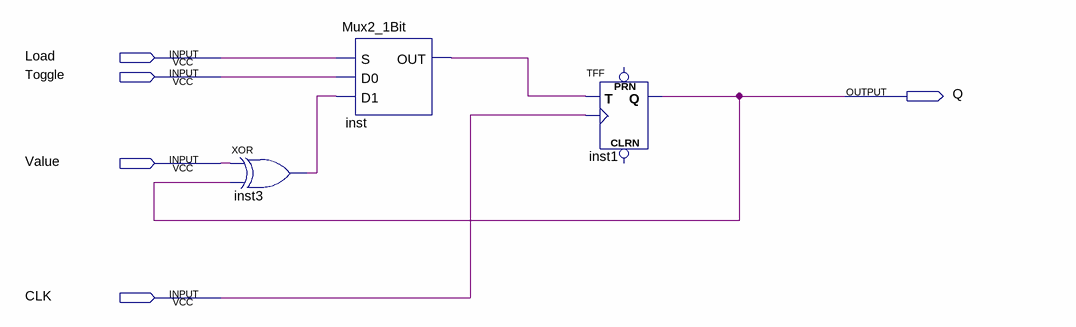
[diagram p0: schematic sheet]
// Quartus schematic TFF_Up.bdf as structural Verilog: 3 symbols, 5 pins
module TFF_Up (
  input  Load,
  input  Toggle,
  input  Value,
  input  CLK,
  output Q
);

  wire inst3_out, inst_out;

  xor inst3 (inst3_out, Value, Q);
  Mux2_1Bit inst (.S(Load), .D0(Toggle), .D1(inst3_out), .OUT(inst_out));
  TFF inst1 (.T(inst_out), .CLK(CLK), .Q(Q));  // open: PRN, CLRN
endmodule
